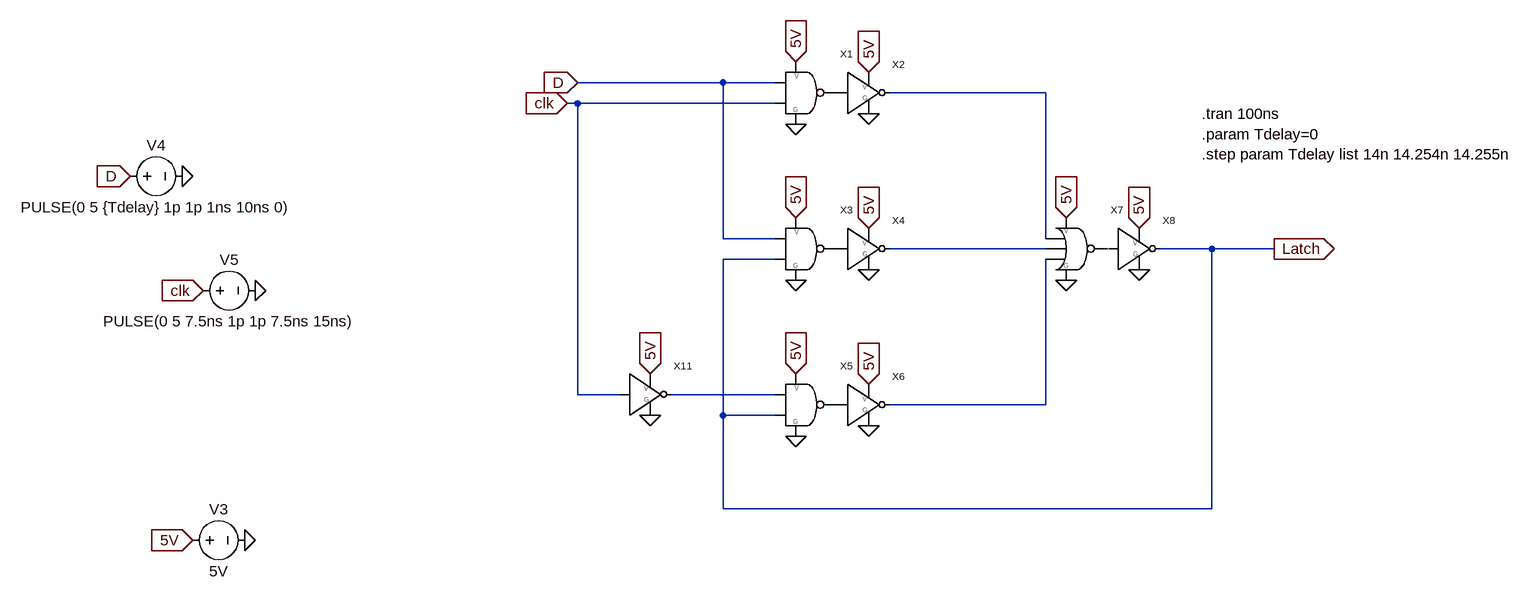
[diagram p0: schematic latch_creado_desde_cero_SETUP.asc]
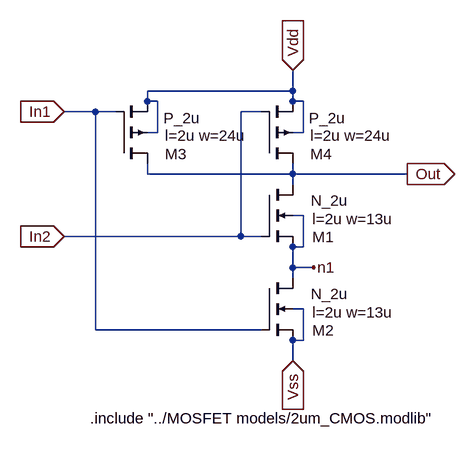
[diagram p1: sub-circuit nand2.asc]
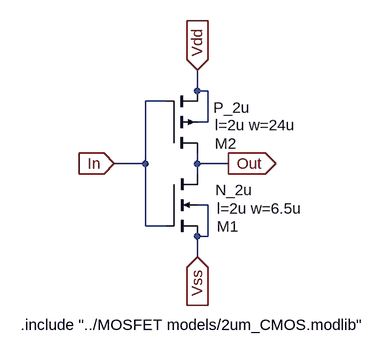
[diagram p2: sub-circuit not.asc]
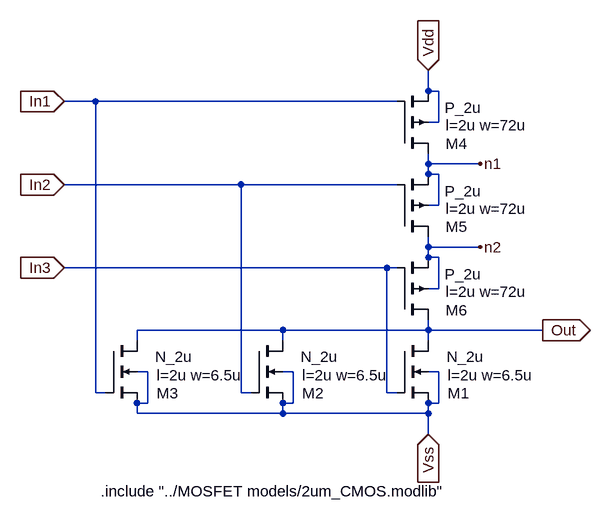
[diagram p3: sub-circuit nor3.asc]
latch_creado_desde_cero_SETUP.asc, the LTspice schematic file:
Version 4
SHEET 1 1304 908
WIRE -96 -48 -320 -48
WIRE -16 -48 -96 -48
WIRE 400 -32 160 -32
WIRE -320 -16 -336 -16
WIRE -16 -16 -320 -16
WIRE -96 192 -96 -48
WIRE -16 192 -96 192
WIRE 400 192 400 -32
WIRE 400 208 160 208
WIRE 656 208 576 208
WIRE 752 208 656 208
WIRE -16 224 -96 224
WIRE -320 432 -320 -16
WIRE -256 432 -320 432
WIRE -16 432 -176 432
WIRE 400 448 400 224
WIRE 400 448 160 448
WIRE -96 464 -96 224
WIRE -16 464 -96 464
WIRE -96 608 -96 464
WIRE 656 608 656 208
WIRE 656 608 -96 608
FLAG -912 656 5V
IOPIN -912 656 In
FLAG -832 656 0
FLAG -928 96 0
FLAG -896 272 clk
IOPIN -896 272 In
FLAG -816 272 0
FLAG -1008 96 D
IOPIN -1008 96 In
FLAG 16 -80 5V
IOPIN 16 -80 In
FLAG 128 -64 5V
IOPIN 128 -64 In
FLAG 128 176 5V
IOPIN 128 176 In
FLAG 16 160 5V
IOPIN 16 160 In
FLAG 16 400 5V
IOPIN 16 400 In
FLAG 128 416 5V
IOPIN 128 416 In
FLAG 432 160 5V
IOPIN 432 160 In
FLAG 128 0 0
FLAG 16 16 0
FLAG 16 256 0
FLAG 128 240 0
FLAG 432 256 0
FLAG 128 480 0
FLAG 16 496 0
FLAG 544 240 0
FLAG 544 176 5V
IOPIN 544 176 In
FLAG 752 208 Latch
IOPIN 752 208 Out
FLAG -208 400 5V
IOPIN -208 400 In
FLAG -208 464 0
FLAG -320 -48 D
IOPIN -320 -48 In
FLAG -336 -16 clk
IOPIN -336 -16 In
SYMBOL NAND2 0 -32 R0
SYMATTR InstName X1
SYMBOL NOT 96 -32 R0
SYMATTR InstName X2
SYMBOL NAND2 0 208 R0
SYMATTR InstName X3
SYMBOL NOT 96 208 R0
SYMATTR InstName X4
SYMBOL NAND2 0 448 R0
SYMATTR InstName X5
SYMBOL NOT 96 448 R0
SYMATTR InstName X6
SYMBOL NOT 512 208 R0
SYMATTR InstName X8
SYMBOL NOR3 416 208 R0
SYMATTR InstName X7
SYMBOL voltage -928 656 R270
WINDOW 0 32 56 VTop 2
WINDOW 3 -32 56 VBottom 2
WINDOW 123 0 0 Left 0
WINDOW 39 0 0 Left 0
SYMATTR InstName V3
SYMATTR Value 5V
SYMBOL voltage -1024 96 R270
WINDOW 0 32 56 VTop 2
WINDOW 3 -32 56 VBottom 2
WINDOW 123 0 0 Left 0
WINDOW 39 0 0 Left 0
SYMATTR InstName V4
SYMATTR Value PULSE(0 5 {Tdelay} 1p 1p 1ns 10ns 0)
SYMBOL voltage -912 272 R270
WINDOW 0 32 56 VTop 2
WINDOW 3 -32 56 VBottom 2
WINDOW 123 0 0 Left 0
WINDOW 39 0 0 Left 0
SYMATTR InstName V5
SYMATTR Value PULSE(0 5 7.5ns 1p 1p 7.5ns 15ns)
SYMBOL NOT -240 432 R0
SYMATTR InstName X11
TEXT 640 0 Left 2 !.tran 100ns\n.param Tdelay=0\n.step param Tdelay list 14n 14.254n 14.255n

nand2.asc, the sub-circuit schematic file:
Version 4
SHEET 1 880 680
WIRE 192 48 192 16
WIRE 192 48 -32 48
WIRE -32 64 -32 48
WIRE -16 64 -32 64
WIRE 192 64 192 48
WIRE 208 64 192 64
WIRE -112 80 -160 80
WIRE -80 80 -112 80
WIRE 144 80 112 80
WIRE -16 112 -16 64
WIRE -16 112 -32 112
WIRE 208 112 208 64
WIRE 208 112 192 112
WIRE -32 176 -32 160
WIRE 192 176 192 160
WIRE 192 176 -32 176
WIRE 368 176 192 176
WIRE 192 192 192 176
WIRE 208 240 192 240
WIRE 112 272 112 80
WIRE 112 272 -160 272
WIRE 144 272 112 272
WIRE 208 288 208 240
WIRE 208 288 192 288
WIRE 192 320 192 288
WIRE 224 320 192 320
WIRE 192 336 192 320
WIRE 208 384 192 384
WIRE -112 416 -112 80
WIRE 144 416 -112 416
WIRE 208 432 208 384
WIRE 208 432 192 432
WIRE 192 464 192 432
FLAG 192 16 Vdd
IOPIN 192 16 In
FLAG 192 464 Vss
IOPIN 192 464 In
FLAG -160 80 In1
IOPIN -160 80 In
FLAG -160 272 In2
IOPIN -160 272 In
FLAG 368 176 Out
IOPIN 368 176 Out
FLAG 224 320 n1
SYMBOL nmos4 144 192 R0
WINDOW 0 78 81 Left 2
WINDOW 3 76 25 Left 2
WINDOW 123 78 53 Left 2
SYMATTR InstName M1
SYMATTR Value N_2u
SYMATTR Value2 l=2u w=13u
SYMBOL pmos4 144 160 M180
WINDOW 0 75 15 Left 2
WINDOW 3 73 70 Left 2
WINDOW 123 75 43 Left 2
SYMATTR InstName M4
SYMATTR Value P_2u
SYMATTR Value2 l=2u w=24u
SYMBOL pmos4 -80 160 M180
WINDOW 0 75 15 Left 2
WINDOW 3 73 70 Left 2
WINDOW 123 75 43 Left 2
SYMATTR InstName M3
SYMATTR Value P_2u
SYMATTR Value2 l=2u w=24u
SYMBOL nmos4 144 336 R0
WINDOW 0 78 81 Left 2
WINDOW 3 76 25 Left 2
WINDOW 123 78 53 Left 2
SYMATTR InstName M2
SYMATTR Value N_2u
SYMATTR Value2 l=2u w=13u
TEXT -120 552 Left 2 !.include "../MOSFET models/2um_CMOS.modlib"

not.asc, the sub-circuit schematic file:
Version 4
SHEET 1 880 680
WIRE 192 64 192 32
WIRE 208 64 192 64
WIRE 144 80 112 80
WIRE 208 112 208 64
WIRE 208 112 192 112
WIRE 112 176 112 80
WIRE 112 176 64 176
WIRE 192 176 192 160
WIRE 240 176 192 176
WIRE 192 192 192 176
WIRE 208 240 192 240
WIRE 112 272 112 176
WIRE 144 272 112 272
WIRE 208 288 208 240
WIRE 208 288 192 288
WIRE 192 320 192 288
FLAG 192 32 Vdd
IOPIN 192 32 In
FLAG 192 320 Vss
IOPIN 192 320 In
FLAG 64 176 In
IOPIN 64 176 In
FLAG 240 176 Out
IOPIN 240 176 Out
SYMBOL nmos4 144 192 R0
WINDOW 0 78 81 Left 2
WINDOW 3 76 25 Left 2
WINDOW 123 78 53 Left 2
SYMATTR InstName M1
SYMATTR Value N_2u
SYMATTR Value2 l=2u w=6.5u
SYMBOL pmos4 144 160 M180
WINDOW 0 75 15 Left 2
WINDOW 3 73 70 Left 2
WINDOW 123 75 43 Left 2
SYMATTR InstName M2
SYMATTR Value P_2u
SYMATTR Value2 l=2u w=24u
TEXT -80 424 Left 2 !.include "../MOSFET models/2um_CMOS.modlib"

nor3.asc, the sub-circuit schematic file:
Version 4
SHEET 1 880 872
WIRE 192 -192 192 -224
WIRE 208 -192 192 -192
WIRE -320 -176 -368 -176
WIRE 144 -176 -320 -176
WIRE 208 -144 208 -192
WIRE 208 -144 192 -144
WIRE 192 -80 192 -96
WIRE 272 -80 192 -80
WIRE 192 -64 192 -80
WIRE 208 -64 192 -64
WIRE -96 -48 -368 -48
WIRE 144 -48 -96 -48
WIRE 208 -16 208 -64
WIRE 208 -16 192 -16
WIRE 192 48 192 32
WIRE 272 48 192 48
WIRE 192 64 192 48
WIRE 208 64 192 64
WIRE 128 80 -368 80
WIRE 144 80 128 80
WIRE 208 112 208 64
WIRE 208 112 192 112
WIRE -32 176 -256 176
WIRE 192 176 192 160
WIRE 192 176 -32 176
WIRE 368 176 192 176
WIRE -256 192 -256 176
WIRE -32 192 -32 176
WIRE 192 192 192 176
WIRE -240 240 -256 240
WIRE -16 240 -32 240
WIRE 208 240 192 240
WIRE -320 272 -320 -176
WIRE -304 272 -320 272
WIRE -96 272 -96 -48
WIRE -80 272 -96 272
WIRE 128 272 128 80
WIRE 144 272 128 272
WIRE -240 288 -240 240
WIRE -240 288 -256 288
WIRE -16 288 -16 240
WIRE -16 288 -32 288
WIRE 208 288 208 240
WIRE 208 288 192 288
WIRE -256 304 -256 288
WIRE -32 304 -32 288
WIRE -32 304 -256 304
WIRE 192 304 192 288
WIRE 192 304 -32 304
WIRE 192 336 192 304
FLAG 192 -224 Vdd
IOPIN 192 -224 In
FLAG 192 336 Vss
IOPIN 192 336 In
FLAG -368 -176 In1
IOPIN -368 -176 In
FLAG -368 -48 In2
IOPIN -368 -48 In
FLAG 368 176 Out
IOPIN 368 176 Out
FLAG -368 80 In3
IOPIN -368 80 In
FLAG 272 -80 n1
FLAG 272 48 n2
SYMBOL nmos4 144 192 R0
WINDOW 0 78 81 Left 2
WINDOW 3 76 25 Left 2
WINDOW 123 78 53 Left 2
SYMATTR InstName M1
SYMATTR Value N_2u
SYMATTR Value2 l=2u w=6.5u
SYMBOL pmos4 144 160 M180
WINDOW 0 75 15 Left 2
WINDOW 3 73 70 Left 2
WINDOW 123 75 43 Left 2
SYMATTR InstName M6
SYMATTR Value P_2u
SYMATTR Value2 l=2u w=72u
SYMBOL pmos4 144 32 M180
WINDOW 0 75 15 Left 2
WINDOW 3 73 70 Left 2
WINDOW 123 75 43 Left 2
SYMATTR InstName M5
SYMATTR Value P_2u
SYMATTR Value2 l=2u w=72u
SYMBOL nmos4 -304 192 R0
WINDOW 0 78 81 Left 2
WINDOW 3 76 25 Left 2
WINDOW 123 78 53 Left 2
SYMATTR InstName M3
SYMATTR Value N_2u
SYMATTR Value2 l=2u w=6.5u
SYMBOL pmos4 144 -96 M180
WINDOW 0 75 15 Left 2
WINDOW 3 73 70 Left 2
WINDOW 123 75 43 Left 2
SYMATTR InstName M4
SYMATTR Value P_2u
SYMATTR Value2 l=2u w=72u
SYMBOL nmos4 -80 192 R0
WINDOW 0 78 81 Left 2
WINDOW 3 76 25 Left 2
WINDOW 123 78 53 Left 2
SYMATTR InstName M2
SYMATTR Value N_2u
SYMATTR Value2 l=2u w=6.5u
TEXT -312 424 Left 2 !.include "../MOSFET models/2um_CMOS.modlib"

The netlist it stands for:
* latch_creado_desde_cero_SETUP.asc
XX1 D clk P001 5V 0 nand2
XX2 P001 N001 5V 0 not
XX3 D Latch P002 5V 0 nand2
XX4 P002 N002 5V 0 not
XX5 N003 Latch P003 5V 0 nand2
XX6 P003 N004 5V 0 not
XX8 P004 Latch 5V 0 not
XX7 N001 N002 N004 P004 5V 0 nor3
V3 5V 0 5V
V4 D 0 PULSE(0 5 {Tdelay} 1p 1p 1ns 10ns 0)
V5 clk 0 PULSE(0 5 7.5ns 1p 1p 7.5ns 15ns)
XX11 clk N003 5V 0 not

* block symbol definitions
.subckt nand2 In1 In2 Out Vdd Vss
M1 Out In2 n1 n1 N_2u l=2u w=13u
M4 Out In2 Vdd Vdd P_2u l=2u w=24u
M3 Out In1 Vdd Vdd P_2u l=2u w=24u
M2 n1 In1 Vss Vss N_2u l=2u w=13u
.include "../MOSFET models/2um_CMOS.modlib"
.ends nand2

.subckt not In Out Vdd Vss
M1 Out In Vss Vss N_2u l=2u w=6.5u
M2 Out In Vdd Vdd P_2u l=2u w=24u
.include "../MOSFET models/2um_CMOS.modlib"
.ends not

.subckt nor3 In1 In2 In3 Out Vdd Vss
M1 Out In3 Vss Vss N_2u l=2u w=6.5u
M6 Out In3 n2 n2 P_2u l=2u w=72u
M5 n2 In2 n1 n1 P_2u l=2u w=72u
M3 Out In1 Vss Vss N_2u l=2u w=6.5u
M4 n1 In1 Vdd Vdd P_2u l=2u w=72u
M2 Out In2 Vss Vss N_2u l=2u w=6.5u
.include "../MOSFET models/2um_CMOS.modlib"
.ends nor3

.model NMOS NMOS
.model PMOS PMOS
.lib standard.mos
.tran 100ns
.param Tdelay=0
.step param Tdelay list 14n 14.254n 14.255n
.backanno
.end

* Results of the author's LTspice run, read from the files saved beside the schematic
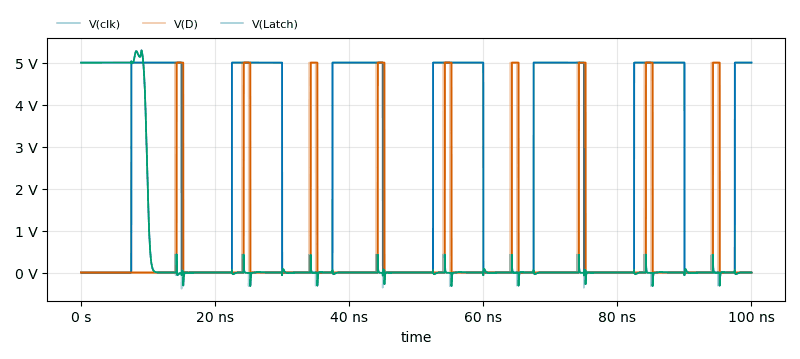
[diagram p4: Transient Analysis of latch_creado_desde_cero_SETUP.asc, plotted from the saved traces]
* Transient Analysis, 3 runs:
*   V(clk) [tdelay=1.4e-08]: min 0 V, max 5 V, average 2.375 V, rms 3.446 V, last 5 V
*   V(clk) [tdelay=1.4254e-08]: min 0 V, max 5 V, average 2.375 V, rms 3.446 V, last 5 V
*   V(clk) [tdelay=1.4255e-08]: min 0 V, max 5 V, average 2.375 V, rms 3.446 V, last 5 V
*   V(D) [tdelay=1.4e-08]: min 0 V, max 5 V, average 450.5 mV, rms 1.501 V, last 0 V
*   V(D) [tdelay=1.4254e-08]: min 0 V, max 5 V, average 450.5 mV, rms 1.501 V, last 0 V
*   V(D) [tdelay=1.4255e-08]: min 0 V, max 5 V, average 450.5 mV, rms 1.501 V, last 0 V
*   V(Latch) [tdelay=1.4e-08]: min -387.3 mV, max 5.292 V, average 497 mV, rms 1.567 V, last 605.8 µV
*   V(Latch) [tdelay=1.4254e-08]: min -322.7 mV, max 5.292 V, average 497 mV, rms 1.567 V, last 607.8 µV
*   V(Latch) [tdelay=1.4255e-08]: min -322.7 mV, max 5.292 V, average 497 mV, rms 1.567 V, last 609.6 µV